# EAGLE schematic Amplifier ckt 02 (EAGLE 6.5.0)
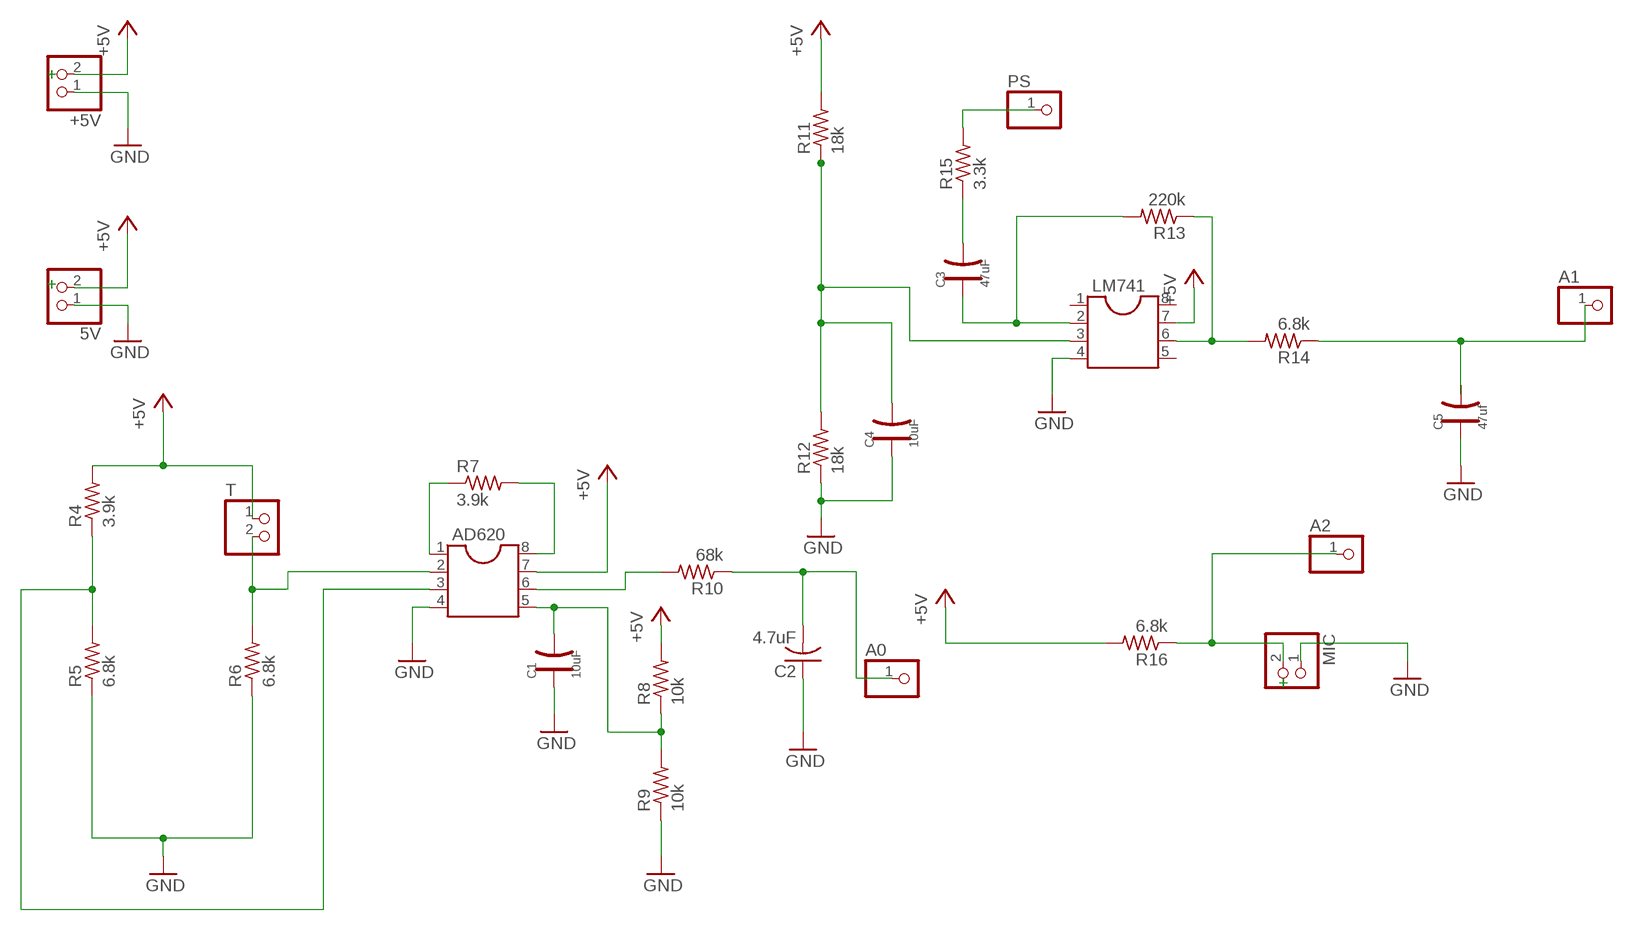
[diagram p0: schematic, sheet 1]

## Parts
5V  PINHD-1X2  [1X02]
+5V  PINHD-1X2  [1X02]
A0  PINHD-1X1  [1X01]
A1  PINHD-1X1  [1X01]
A2  PINHD-1X1  [1X01]
AD620  DIL8S  [SOCKET-08]
C1  10uF  CAP-POLAR-AVX-B  [AVX-B]
C2  4.7uF  C-USC0805  [C0805]
C3  47uF  CAP-POLAR-AVX-B  [AVX-B]
C4  10uF  CAP-POLAR-AVX-B  [AVX-B]
C5  47uf  CAP-POLAR-AVX-B  [AVX-B]
LM741  DIL8S  [SOCKET-08]
MIC  PINHD-1X2  [1X02]
PS  PINHD-1X1  [1X01]
R4  3.9k  R-US_R0603  [R0603]
R5  6.8k  R-US_R0603  [R0603]
R6  6.8k  R-US_R0603  [R0603]
R7  3.9k  R-US_R0603  [R0603]
R8  10k  R-US_R0603  [R0603]
R9  10k  R-US_R0603  [R0603]
R10  68k  R-US_R0603  [R0603]
R11  18k  R-US_R0603  [R0603]
R12  18k  R-US_R0603  [R0603]
R13  220k  R-US_R0603  [R0603]
R14  6.8k  R-US_R0603  [R0603]
R15  3.3k  R-US_R0603  [R0603]
R16  6.8k  R-US_R0603  [R0603]
T  PINHD-1X2  [1X02]

## Nets
+5V: 5V.2 +5V.2 AD620.7 LM741.7 R4.2 R8.2 R11.2 R16.2 T.1
A0: A0.1 C2.2 R10.1
A6: A2.1 MIC.2 R16.1
GND: 5V.1 +5V.1 AD620.4 C1.+ C2.1 C4.+ C5.+ LM741.4 MIC.1 R5.1 R6.1 R9.1 R12.1
N$1: A1.1 R14.1
N$2: AD620.5 C1.- R8.1 R9.2
N$6: AD620.2 R6.2 T.2
N$8: AD620.3 R4.1 R5.2
N$9: AD620.1 R7.1
N$10: AD620.8 R7.2
N$11: AD620.6 R10.2
N$14: PS.1 R15.2
N$15: C3.- R15.1
N$17: LM741.6 R13.1 R14.2
N$22: C3.+ LM741.2 R13.2
N$24: C4.- LM741.3 R11.1 R12.2
Unconnected: C5.- LM741.1 LM741.5 LM741.8

## Notes on the sheet
- +
- +
- +

## Library data of the parts
5V +5V MIC T = pinhead:PINHD-1X2: PIN HEADER
A0 A1 A2 PS = pinhead:PINHD-1X1: PIN HEADER
AD620 LM741 = ic-package:DIL8: Dual In Line / Socket
C1 C3-C5 = OPL:CAP-POLAR: Electrolytic Capacitors,Tantalum Capacitors and Super Capacitors
C2 = rcl:C-US: CAPACITOR, American symbol
R4-R16 = rcl:R-US_: RESISTOR, American symbol

## Net classes
0 default: width 0.254 mm, drill 0.508 mm, clearance 0.254 mm